# Altium schematic sheet E-18 M.2.SchDoc: FRDM-IMX93 (part 1 of 2)
size 513 x 386 mm; DrawnBy: FORLINX; Organization: ORGANIZATION; Address1: ADDRESS 1; Address2: ADDRESS 2; Address3: ADDRESS 3; Address4: ADDRESS 4; Revision: -; ENG_APP_DATE: --/--/--; DSN_APP_DATE: --/--/--; CHK_APP_DATE: --/--/--; Classification: Public, Company Internal/Proprietary, Company Confidential,  Company Secret; Page Create Date: March  8, 1995; OrgName: NXP Semiconductor; FIUO: A; OrgAddr1: NO. 192 Liangjing Rd. Pudong New Area, ShangHai; Page Number: 18; PageTitle: M.2; Page Size: C; Page Count: 23; Designer: FORLINX; RevCode: B1; Approver: NXP SE; Doc: SCH-94611 PDF: SPF-94611; DsnPath: T:\FILES\Designs\Single Board Computers\i.MX93-FRDM\Design Files\SCH-94611_B1.DSN; SchematicName: FRDM-i.MX 93 Development Board; PageName: E-18 M.2; PageSize: C; TopSchematic: True
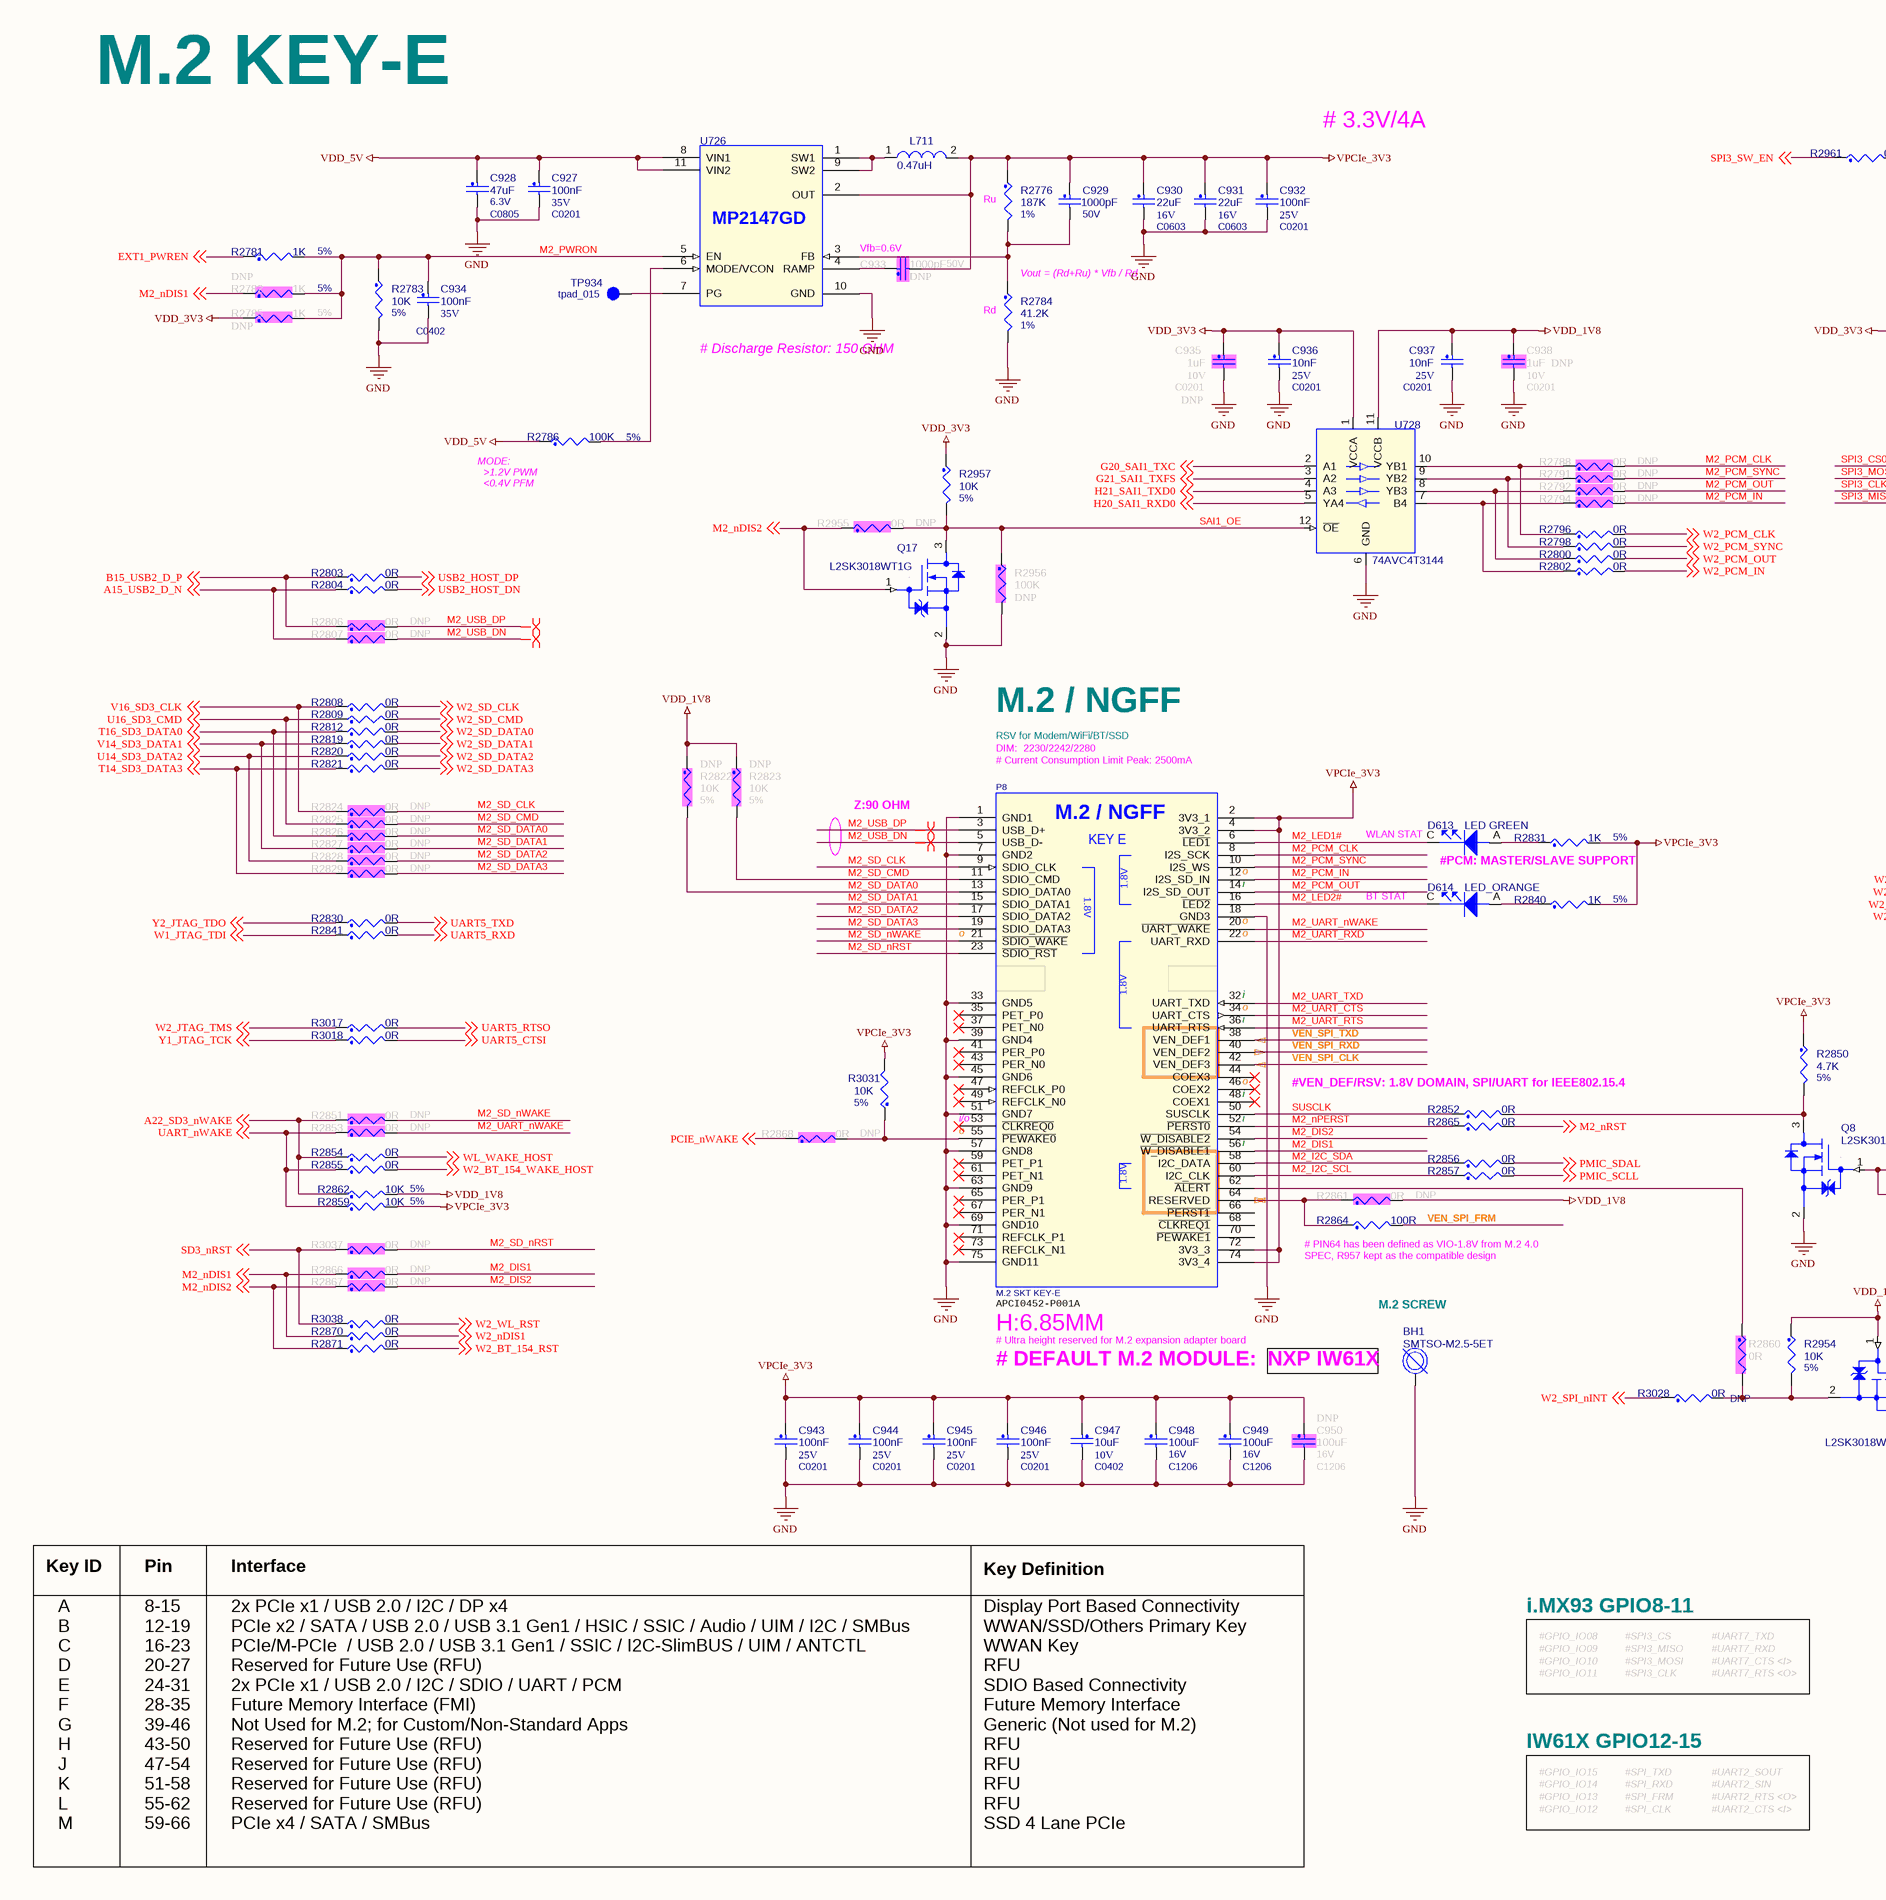
[diagram p0: E-18 M.2.SchDoc, left]
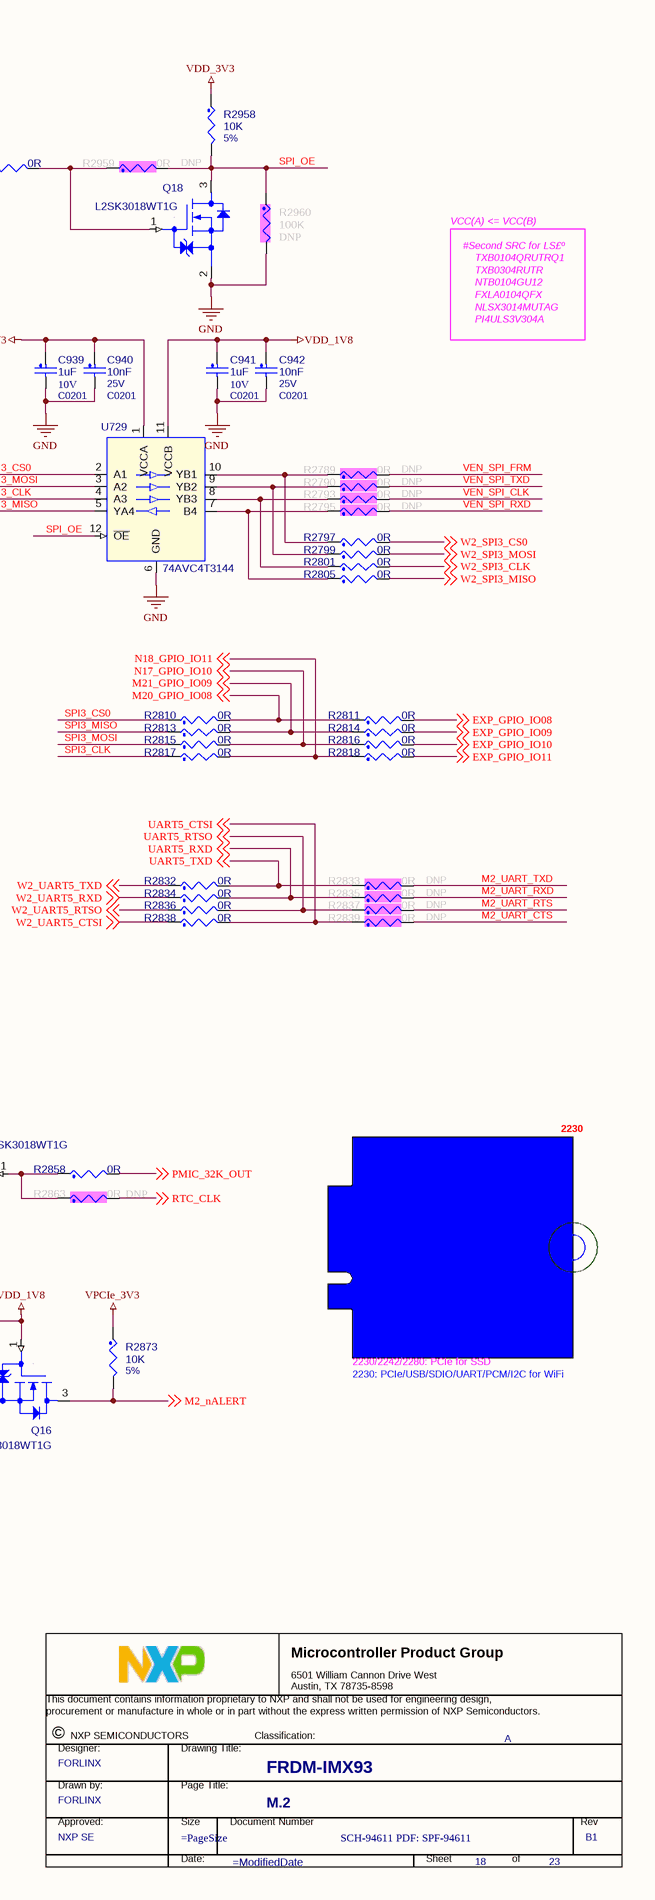
[diagram p1: E-18 M.2.SchDoc, right]

## Parts
*  Title: FRDM-IMX93  RevCode: B1  PageTitle: M.2  Page Number: 18  Page Count: 23  DrawnBy: FORLINX  Doc: SCH-94611 PDF: SPF-94611  Approver: NXP SE  FIUO: A  (graphical)
BH1  SMTSO-M2.5-5ET  [mh244-166t_202h]
C927  100nF  VOLTAGE: 35V  [C0201]
C928  47uF  VOLTAGE: 6.3V  [C0805]
C929  1000pF  VOLTAGE: 50V  [C0402]
C930  22uF  VOLTAGE: 16V  [C0603]
C931  22uF  VOLTAGE: 16V  [C0603]
C932  100nF  VOLTAGE: 25V  [C0201]
C933  1000pF  ASSY_OPT: DNP  VOLTAGE: 50V  [C0402]
C934  100nF  VOLTAGE: 35V  [C0402]
C935  1uF  ASSY_OPT: DNP  VOLTAGE: 10V  [C0201]
C936  10nF  VOLTAGE: 25V  [C0201]
C937  10nF  VOLTAGE: 25V  [C0201]
C938  1uF  ASSY_OPT: DNP  VOLTAGE: 10V  [C0201]
C939  1uF  VOLTAGE: 10V  [C0201]
C940  10nF  VOLTAGE: 25V  [C0201]
C941  1uF  VOLTAGE: 10V  [C0201]
C942  10nF  VOLTAGE: 25V  [C0201]
C943  100nF  VOLTAGE: 25V  [C0201]
C944  100nF  VOLTAGE: 25V  [C0201]
C945  100nF  VOLTAGE: 25V  [C0201]
C946  100nF  VOLTAGE: 25V  [C0201]
C947  10uF  VOLTAGE: 10V  [C0402]
C948  100uF  VOLTAGE: 16V  [C1206]
C949  100uF  VOLTAGE: 16V  [C1206]
C950  100uF  ASSY_OPT: DNP  VOLTAGE: 16V  [C1206]
D613  LED GREEN  [led0603]
D614  LED_ORANGE  [led0603]
L711  0.47uH  [ind_sph2520]
P8  M.2 SKT KEY-E  [con_75_0p5_22x9_ra1]
Q8  L2SK3018WT1G  [sc70_3]
Q16  L2SK3018WT1G  [sc70_3]
Q17  L2SK3018WT1G  [sc70_3]
Q18  L2SK3018WT1G  [sc70_3]
R2776  187K  Tolerance: 1%  [R0402]
R2781  1K  Tolerance: 5%  [R0201]
R2782  1K  ASSY_OPT: DNP  Tolerance: 5%  [R0201]
R2783  10K  Tolerance: 5%  [R0201]
R2784  41.2K  Tolerance: 1%  [R0402]
R2785  1K  ASSY_OPT: DNP  Tolerance: 5%  [R0201]
R2786  100K  Tolerance: 5%  [R0201]
R2788  0R  ASSY_OPT: DNP  [R0402]
R2789  0R  ASSY_OPT: DNP  [R0402]
R2790  0R  ASSY_OPT: DNP  [R0402]
R2791  0R  ASSY_OPT: DNP  [R0402]
R2792  0R  ASSY_OPT: DNP  [R0402]
R2793  0R  ASSY_OPT: DNP  [R0402]
R2794  0R  ASSY_OPT: DNP  [R0402]
R2795  0R  ASSY_OPT: DNP  [R0402]
R2796  0R  [R0402]
R2797  0R  [R0402]
R2798  0R  [R0402]
R2799  0R  [R0402]
R2800  0R  [R0402]
R2801  0R  [R0402]
R2802  0R  [R0402]
R2803  0R  [R0402]
R2804  0R  [R0402]
R2805  0R  [R0402]
R2806  0R  ASSY_OPT: DNP  [R0402]
R2807  0R  ASSY_OPT: DNP  [R0402]
R2808  0R  [R0402]
R2809  0R  [R0402]
R2810  0R  [R0402]
R2811  0R  [R0402]
R2812  0R  [R0402]
R2813  0R  [R0402]
R2814  0R  [R0402]
R2815  0R  [R0402]
R2816  0R  [R0402]
R2817  0R  [R0402]
R2818  0R  [R0402]
R2819  0R  [R0402]
R2820  0R  [R0402]
R2821  0R  [R0402]
R2822  10K  ASSY_OPT: DNP  Tolerance: 5%  [R0402]
R2823  10K  ASSY_OPT: DNP  Tolerance: 5%  [R0402]
R2824  0R  ASSY_OPT: DNP  [R0402]
R2825  0R  ASSY_OPT: DNP  [R0402]
R2826  0R  ASSY_OPT: DNP  [R0402]
R2827  0R  ASSY_OPT: DNP  [R0402]
R2828  0R  ASSY_OPT: DNP  [R0402]
R2829  0R  ASSY_OPT: DNP  [R0402]
R2830  0R  [R0402]
R2831  1K  Tolerance: 5%  [R0201]
R2832  0R  [R0402]
R2833  0R  ASSY_OPT: DNP  [R0402]
R2834  0R  [R0402]
R2835  0R  ASSY_OPT: DNP  [R0402]
R2836  0R  [R0402]
R2837  0R  ASSY_OPT: DNP  [R0402]
R2838  0R  [R0402]
R2839  0R  ASSY_OPT: DNP  [R0402]
R2840  1K  Tolerance: 5%  [R0201]
R2841  0R  [R0402]
R2850  4.7K  Tolerance: 5%  [R0402]
R2851  0R  ASSY_OPT: DNP  [R0402]
R2852  0R  [R0201]
R2853  0R  ASSY_OPT: DNP  [R0402]
R2854  0R  [R0402]
R2855  0R  [R0402]
R2856  0R  [R0201]
R2857  0R  [R0201]
R2858  0R  [R0201]
R2859  10K  Tolerance: 5%  [R0201]
R2860  0R  ASSY_OPT: DNP  [R0402]
R2861  0R  ASSY_OPT: DNP  [R0201]
R2862  10K  Tolerance: 5%  [R0201]
R2863  0R  ASSY_OPT: DNP  [R0201]
R2864  100R  [R0201]
R2865  0R  [R0201]
R2866  0R  ASSY_OPT: DNP  [R0402]
R2867  0R  ASSY_OPT: DNP  [R0402]
R2868  0R  ASSY_OPT: DNP  [R0201]
R2870  0R  [R0402]
R2871  0R  [R0402]
R2873  10K  Tolerance: 5%  [R0201]
R2954  10K  Tolerance: 5%  [R0201]
R2955  0R  ASSY_OPT: DNP  [R0201]
R2956  100K  ASSY_OPT: DNP  [R0201]
R2957  10K  Tolerance: 5%  [R0201]
R2958  10K  Tolerance: 5%  [R0201]
R2959  0R  ASSY_OPT: DNP  [R0201]
R2960  100K  ASSY_OPT: DNP  [R0201]
R2961  0R  [R0201]
R3017  0R  [R0402]
R3018  0R  [R0402]
R3028  0R  [R0402]
R3031  10K  Tolerance: 5%  [R0201]
R3037  0R  ASSY_OPT: DNP  [R0402]
R3038  0R  [R0402]
TP934  TPAD_015  [tpad_015]
U726  MP2147GD  [qfn12_0p5_2x3mm_ep]
U728  74AVC4T3144  [uqfn12_1p7x2mm]
U729  74AVC4T3144  [uqfn12_1p7x2mm]

## Nets
GND: BH1.1 C927.2 C928.2 C930.2 C931.2 C932.2 C934.2 C935.2 C936.2 C937.2 C938.2 C939.2 C940.2 C941.2 C942.2 C943.2 C944.2 C945.2 C946.2 C947.2 C948.2 C949.2 C950.2 P8.1(GND1) P8.7(GND2) P8.18(GND3) P8.33(GND5) P8.39(GND4) P8.45(GND6) P8.51(GND7) P8.57(GND8) P8.63(GND9) P8.69(GND10) P8.75(GND11) Q8.2(SOURCE) Q17.2(SOURCE) Q18.2(SOURCE) R2783.2 R2784.2 R2956.2 R2960.2 U726.10(GND) U728.6(GND) U729.6(GND)
VDD_1V8: C937.1 C938.1 C941.1 C942.1 Q16.1(GATE) R2822.1 R2823.1 R2861.2 R2862.2 R2954.1 U728.11(VCCB) U729.11(VCCB)
VDD_3V3: C935.1 C936.1 C939.1 C940.1 R2785.1 R2957.1 R2958.1 U728.1(VCCA) U729.1(VCCA)
VDD_5V: C927.1 C928.1 R2786.1 U726.8(VIN1) U726.11(VIN2)
VPCIe_3V3: C929.1 C930.1 C931.1 C932.1 C933.2 C943.1 C944.1 C945.1 C946.1 C947.1 C948.1 C949.1 C950.1 L711.2 P8.2(3V3_1) P8.4(3V3_2) P8.72(3V3_3) P8.74(3V3_4) R2776.1 R2831.2 R2840.2 R2850.1 R2859.2 R2873.1 R3031.2 U726.2(OUT)
A15_USB2_D_N: R2804.1 R2807.1 ; off-sheet A15_USB2_D_N
A22_SD3_nWAKE: R2851.1 R2854.1 R2862.1 ; off-sheet A22_SD3_nWAKE
B15_USB2_D_P: R2803.1 R2806.1 ; off-sheet B15_USB2_D_P
EXP_GPIO_IO08: R2811.2 ; off-sheet EXP_GPIO_IO08
EXP_GPIO_IO09: R2814.2 ; off-sheet EXP_GPIO_IO09
EXP_GPIO_IO10: R2816.2 ; off-sheet EXP_GPIO_IO10
EXP_GPIO_IO11: R2818.2 ; off-sheet EXP_GPIO_IO11
EXT1_PWREN: R2781.1 ; off-sheet EXT1_PWREN
G20_SAI1_TXC: U728.2(A1) ; off-sheet G20_SAI1_TXC
G21_SAI1_TXFS: U728.3(A2) ; off-sheet G21_SAI1_TXFS
H20_SAI1_RXD0: U728.5(YA4) ; off-sheet H20_SAI1_RXD0
H21_SAI1_TXD0: U728.4(A3) ; off-sheet H21_SAI1_TXD0
M2_DIS1: P8.56(~{W_DISABLE1}) R2866.2
M2_DIS2: P8.54(~{W_DISABLE2}) R2867.2
M2_I2C_SCL: P8.60(I2C_CLK) R2857.1
M2_I2C_SDA: P8.58(I2C_DATA) R2856.1
M2_LED1#: D613.C(CATHODE) P8.6(~{LED1})
M2_LED2#: D614.C(CATHODE) P8.16(~{LED2})
M2_nALERT: Q16.3(DRAIN) R2873.2 ; off-sheet M2_nALERT
M2_nDIS1: R2782.1 R2866.1 R2870.1 ; off-sheet M2_nDIS1
M2_nDIS2: Q17.1(GATE) R2867.1 R2871.1 R2955.1 ; off-sheet M2_nDIS2
M2_nPERST: P8.52(~{PERST0}) R2865.1
M2_nRST: R2865.2 ; off-sheet M2_nRST
M2_PCM_CLK: P8.8(I2S_SCK) R2788.2
M2_PCM_IN: P8.12(I2S_SD_IN) R2794.2
M2_PCM_OUT: P8.14(I2S_SD_OUT) R2792.2
M2_PCM_SYNC: P8.10(I2S_WS) R2791.2
M2_PWRON: C934.1 R2781.2 R2782.2 R2783.1 R2785.2 U726.5(EN)
M2_SD_CLK: P8.9(SDIO_CLK) R2824.2
M2_SD_CMD: P8.11(SDIO_CMD) R2823.2 R2825.2
M2_SD_DATA0: P8.13(SDIO_DATA0) R2822.2 R2826.2
M2_SD_DATA1: P8.15(SDIO_DATA1) R2827.2
M2_SD_DATA2: P8.17(SDIO_DATA2) R2828.2
M2_SD_DATA3: P8.19(SDIO_DATA3) R2829.2
M2_SD_nRST: P8.23(~{SDIO_RST}) R3037.2
M2_SD_nWAKE: P8.21(~{SDIO_WAKE}) R2851.2
M2_UART_CTS: P8.34(UART_CTS) R2839.2
M2_UART_nWAKE: P8.20(~{UART_WAKE}) R2853.2
M2_UART_RTS: P8.36(UART_RTS) R2837.2
M2_UART_RXD: P8.22(UART_RXD) R2835.2
M2_UART_TXD: P8.32(UART_TXD) R2833.2
M2_USB_DN: P8.5(USB_D-) R2807.2
M2_USB_DP: P8.3(USB_D+) R2806.2
M20_GPIO_IO08: R2810.2 R2811.1 ; off-sheet M20_GPIO_IO08
M21_GPIO_IO09: R2813.2 R2814.1 ; off-sheet M21_GPIO_IO09
N17_GPIO_IO10: R2815.2 R2816.1 ; off-sheet N17_GPIO_IO10
N18_GPIO_IO11: R2817.2 R2818.1 ; off-sheet N18_GPIO_IO11
PCIE_nWAKE: R2868.1 ; off-sheet PCIE_nWAKE
PMIC_32K_OUT: R2858.2 ; off-sheet PMIC_32K_OUT
PMIC_SCLL: R2857.2 ; off-sheet PMIC_SCLL
PMIC_SDAL: R2856.2 ; off-sheet PMIC_SDAL
RTC_CLK: R2863.2 ; off-sheet RTC_CLK
SAI1_OE: Q17.3(DRAIN) R2955.2 R2956.1 R2957.2 U728.12(~{OE})
SD3_nRST: R3037.1 R3038.1 ; off-sheet SD3_nRST
SPI3_CLK: R2817.1 U729.4(A3)
SPI3_CS0: R2810.1 U729.2(A1)
SPI3_MISO: R2813.1 U729.5(YA4)
SPI3_MOSI: R2815.1 U729.3(A2)
SPI3_SW_EN: R2961.1 ; off-sheet SPI3_SW_EN
SPI_OE: Q18.3(DRAIN) R2958.2 R2959.2 R2960.1 U729.12(~{OE})
SUSCLK: P8.50(SUSCLK) R2852.1
T14_SD3_DATA3: R2821.1 R2829.1 ; off-sheet T14_SD3_DATA3
T16_SD3_DATA0: R2812.1 R2826.1 ; off-sheet T16_SD3_DATA0
U14_SD3_DATA2: R2820.1 R2828.1 ; off-sheet U14_SD3_DATA2
U16_SD3_CMD: R2809.1 R2825.1 ; off-sheet U16_SD3_CMD
UART5_CTSI: R2838.2 R2839.1 R3018.2 ; off-sheet UART5_CTSI
UART5_RTSO: R2836.2 R2837.1 R3017.2 ; off-sheet UART5_RTSO
UART5_RXD: R2834.2 R2835.1 R2841.2 ; off-sheet UART5_RXD
UART5_TXD: R2830.2 R2832.2 R2833.1 ; off-sheet UART5_TXD
UART_nWAKE: R2853.1 R2855.1 R2859.1 ; off-sheet UART_nWAKE
USB2_HOST_DN: R2804.2 ; off-sheet USB2_HOST_DN
USB2_HOST_DP: R2803.2 ; off-sheet USB2_HOST_DP
V14_SD3_DATA1: R2819.1 R2827.1 ; off-sheet V14_SD3_DATA1
V16_SD3_CLK: R2808.1 R2824.1 ; off-sheet V16_SD3_CLK
VEN_SPI_CLK: P8.42(VEN_DEF3) R2793.2
VEN_SPI_FRM: R2789.2 R2864.2
VEN_SPI_RXD: P8.40(VEN_DEF2) R2795.2
VEN_SPI_TXD: P8.38(VEN_DEF1) R2790.2
W1_JTAG_TDI: R2841.1 ; off-sheet W1_JTAG_TDI
W2_BT_154_RST: R2871.2 ; off-sheet W2_BT_154_RST
W2_BT_154_WAKE_HOST: R2855.2 ; off-sheet W2_BT_154_WAKE_HOST
W2_JTAG_TMS: R3017.1 ; off-sheet W2_JTAG_TMS
W2_nDIS1: R2870.2 ; off-sheet W2_nDIS1
W2_PCM_CLK: R2796.2 ; off-sheet W2_PCM_CLK
W2_PCM_IN: R2802.2 ; off-sheet W2_PCM_IN
W2_PCM_OUT: R2800.2 ; off-sheet W2_PCM_OUT
W2_PCM_SYNC: R2798.2 ; off-sheet W2_PCM_SYNC
W2_SD_CLK: R2808.2 ; off-sheet W2_SD_CLK
W2_SD_CMD: R2809.2 ; off-sheet W2_SD_CMD
W2_SD_DATA0: R2812.2 ; off-sheet W2_SD_DATA0
W2_SD_DATA1: R2819.2 ; off-sheet W2_SD_DATA1
W2_SD_DATA2: R2820.2 ; off-sheet W2_SD_DATA2
W2_SD_DATA3: R2821.2 ; off-sheet W2_SD_DATA3
W2_SPI3_CLK: R2801.2 ; off-sheet W2_SPI3_CLK
W2_SPI3_CS0: R2797.2 ; off-sheet W2_SPI3_CS0
W2_SPI3_MISO: R2805.2 ; off-sheet W2_SPI3_MISO
W2_SPI3_MOSI: R2799.2 ; off-sheet W2_SPI3_MOSI
W2_SPI_nINT: R3028.1 ; off-sheet W2_SPI_nINT
W2_UART5_CTSI: R2838.1 ; off-sheet W2_UART5_CTSI
W2_UART5_RTSO: R2836.1 ; off-sheet W2_UART5_RTSO
W2_UART5_RXD: R2834.1 ; off-sheet W2_UART5_RXD
W2_UART5_TXD: R2832.1 ; off-sheet W2_UART5_TXD
W2_WL_RST: R3038.2 ; off-sheet W2_WL_RST
WL_WAKE_HOST: R2854.2 ; off-sheet WL_WAKE_HOST
Y1_JTAG_TCK: R3018.1 ; off-sheet Y1_JTAG_TCK
Y2_JTAG_TDO: R2830.1 ; off-sheet Y2_JTAG_TDO
NetC929_2: C929.2 R2776.2 R2784.1 U726.3(FB)
NetC933_1: C933.1 U726.4(RAMP)
NetD613_A: D613.A(ANODE) R2831.1
NetD614_A: D614.A(ANODE) R2840.1
NetL711_1: L711.1 U726.1(SW1) U726.9(SW2)
NetP8_55: P8.55(~{PEWAKE0}) R2868.2 R3031.1
NetP8_62: P8.62(~{ALERT}) R2860.1
NetP8_64: P8.64(RESERVED) R2861.1 R2864.1
NetQ8_1: Q8.1(GATE) R2858.1 R2863.1
NetQ8_3: Q8.3(DRAIN) R2850.2 R2852.2
NetQ16_2: Q16.2(SOURCE) R2860.2 R2954.2 R3028.2
NetQ18_1: Q18.1(GATE) R2959.1 R2961.2
NetR2786_2: R2786.2 U726.6(MODE/VCON)
NetR2788_1: R2788.1 R2796.1 U728.10(YB1)
NetR2789_1: R2789.1 R2797.1 U729.10(YB1)
NetR2790_1: R2790.1 R2799.1 U729.9(YB2)
NetR2791_1: R2791.1 R2798.1 U728.9(YB2)
NetR2792_1: R2792.1 R2800.1 U728.8(YB3)
NetR2793_1: R2793.1 R2801.1 U729.8(YB3)
NetR2794_1: R2794.1 R2802.1 U728.7(B4)
NetR2795_1: R2795.1 R2805.1 U729.7(B4)
NetTP934_1: TP934.1(Pin1) U726.7(PG)

Not connected (* = marked no-connect by the designer): P8 35(PET_P0)* 37(PET_N0)* 41(PER_P0)* 43(PER_N0)* 44(COEX3)* 46(COEX2)* 47(REFCLK_P0)* 48(COEX1)* 49(REFCLK_N0)* 53(~{CLKREQ0})* 59(PET_P1)* 61(PET_N1)* 65(PER_P1)* 66(~{PERST1}) 67(PER_N1)* 68(~{CLKREQ1}) 70(~{PEWAKE1}) 71(REFCLK_P1)* 73(REFCLK_N1)*

## Layout directives
differential pair: M2_USB_DN, M2_USB_DP

## Notes on the sheet
- M.2 KEY-E
- # 3.3V/4A
- (near R2776) Ru
- VCC(A) <= VCC(B)
- #Second SRC for LS£º
- (near C933) Vfb=0.6V
- (near R2784) Vout = (Rd+Ru) * Vfb / Rd
- NLSX3014MUTAG
- NTB0104GU12
- TXB0304RUTR
- FXLA0104QFX
- TXB0104QRUTRQ1
- # Discharge Resistor: 150 OHM
- (near R2784) Rd
- PI4ULS3V304A
- (near R2786) MODE:
  >1.2V PWM
  <0.4V PFM
- M.2 / NGFF
- # Current Consumption Limit Peak: 2500mA
- DIM:  2230/2242/2280
- RSV for Modem/WiFi/BT/SSD
- Z:90 OHM
- (near D613) WLAN STAT
- (near P8) o
- (near P8) i
- (near D614) BT STAT
- #PCM: MASTER/SLAVE SUPPORT
- #VEN_DEF/RSV: 1.8V DOMAIN, SPI/UART for IEEE802.15.4
- (near P8) i/o
- 2230
- (near R2864) # PIN64 has been defined as VIO-1.8V from M.2 4.0
  SPEC, R957 kept as the compatible design
- (near P8) APCI0452-P001A
- # Ultra height reserved for M.2 expansion adapter board
- H:6.85MM
- M.2 SCREW
- # DEFAULT M.2 MODULE:
- NXP IW61X
- 2230: PCIe/USB/SDIO/UART/PCM/I2C for WiFi
- 2230/2242/2280: PCIe for SSD
- Key ID
- Pin
- Interface
- Key Definition
- i.MX93 GPIO8-11
- #GPIO_IO09
- #GPIO_IO08
- #SPI3_MISO
- #SPI3_CS
- #UART7_TXD
- #UART7_RXD
- #GPIO_IO11
- #GPIO_IO10
- #SPI3_CLK
- #SPI3_MOSI
- #UART7_RTS <O>
- #UART7_CTS <I>
- IW61X GPIO12-15
- #GPIO_IO15
- #SPI_TXD
- #UART2_SOUT
- A
  B
  C
  D
  E
  F
  G
  H
  J
  K
  L
  M
- 8-15
  12-19
  16-23
  20-27
  24-31
  28-35
  39-46
  43-50
  47-54
  51-58
  55-62
  59-66
- 2x PCIe x1 / USB 2.0 / I2C / DP x4
  PCIe x2 / SATA / USB 2.0 / USB 3.1 Gen1 / HSIC / SSIC / Audio / UIM / I2C / SMBus
  PCIe/M-PCIe  / USB 2.0 / USB 3.1 Gen1 / SSIC / I2C-SlimBUS / UIM / ANTCTL
  Reserved for Future Use (RFU)
  2x PCIe x1 / USB 2.0 / I2C / SDIO / UART / PCM
  Future Memory Interface (FMI)
  Not Used for M.2; for Custom/Non-Standard Apps
  Reserved for Future Use (RFU)
  Reserved for Future Use (RFU)
  Reserved for Future Use (RFU)
  Reserved for Future Use (RFU)
  PCIe x4 / SATA / SMBus
- Display Port Based Connectivity
  WWAN/SSD/Others Primary Key
  WWAN Key
  RFU
  SDIO Based Connectivity
  Future Memory Interface
  Generic (Not used for M.2)
  RFU
  RFU
  RFU
  RFU
  SSD 4 Lane PCIe
- #GPIO_IO12
- #GPIO_IO13
- #GPIO_IO14
- #SPI_CLK
- #SPI_FRM
- #SPI_RXD
- #UART2_RTS <O>
- #UART2_SIN
- #UART2_CTS <I>
- DWG. NO.
- REV.
- SHT.
- REVISION
- DESCRIPTION
- DATE
- APPROVED
- ENG:
- APPROVALS
- quilter.ai <http://quilter.ai>
- DSN:
- CHK:
- REFERENCE DOCUMENTS
- TITLE
- PROJECT
- BOM:
- FAB DWG:
- PCB DWG:
- ASSY DWG:
- SIZE
- FILE NAME
- C
- DWG NO.
- SHEET
- OF
- REV
- (in symbol CON_67_FEMALE_RA_B) M.2 / NGFF; KEY E; 1.8V
- (in symbol TitleBlock_MCPG) Microcontroller Product Group; 6501 William Cannon Drive West / Austin, TX 78735-8598; This document contains information proprietary to NXP and shall not be used for engineering design,; procurement or manufacture in whole or in part without the express written permission of NXP Semiconductors.; ©; NXP SEMICONDUCTORS; Classification:; Designer:; Drawing Title:; Drawn by:; Page Title:; Approved:; Size; Document Number; Rev; Date:; Sheet; of